# Altium project Weapon_of_Aphelios.PrjPcb
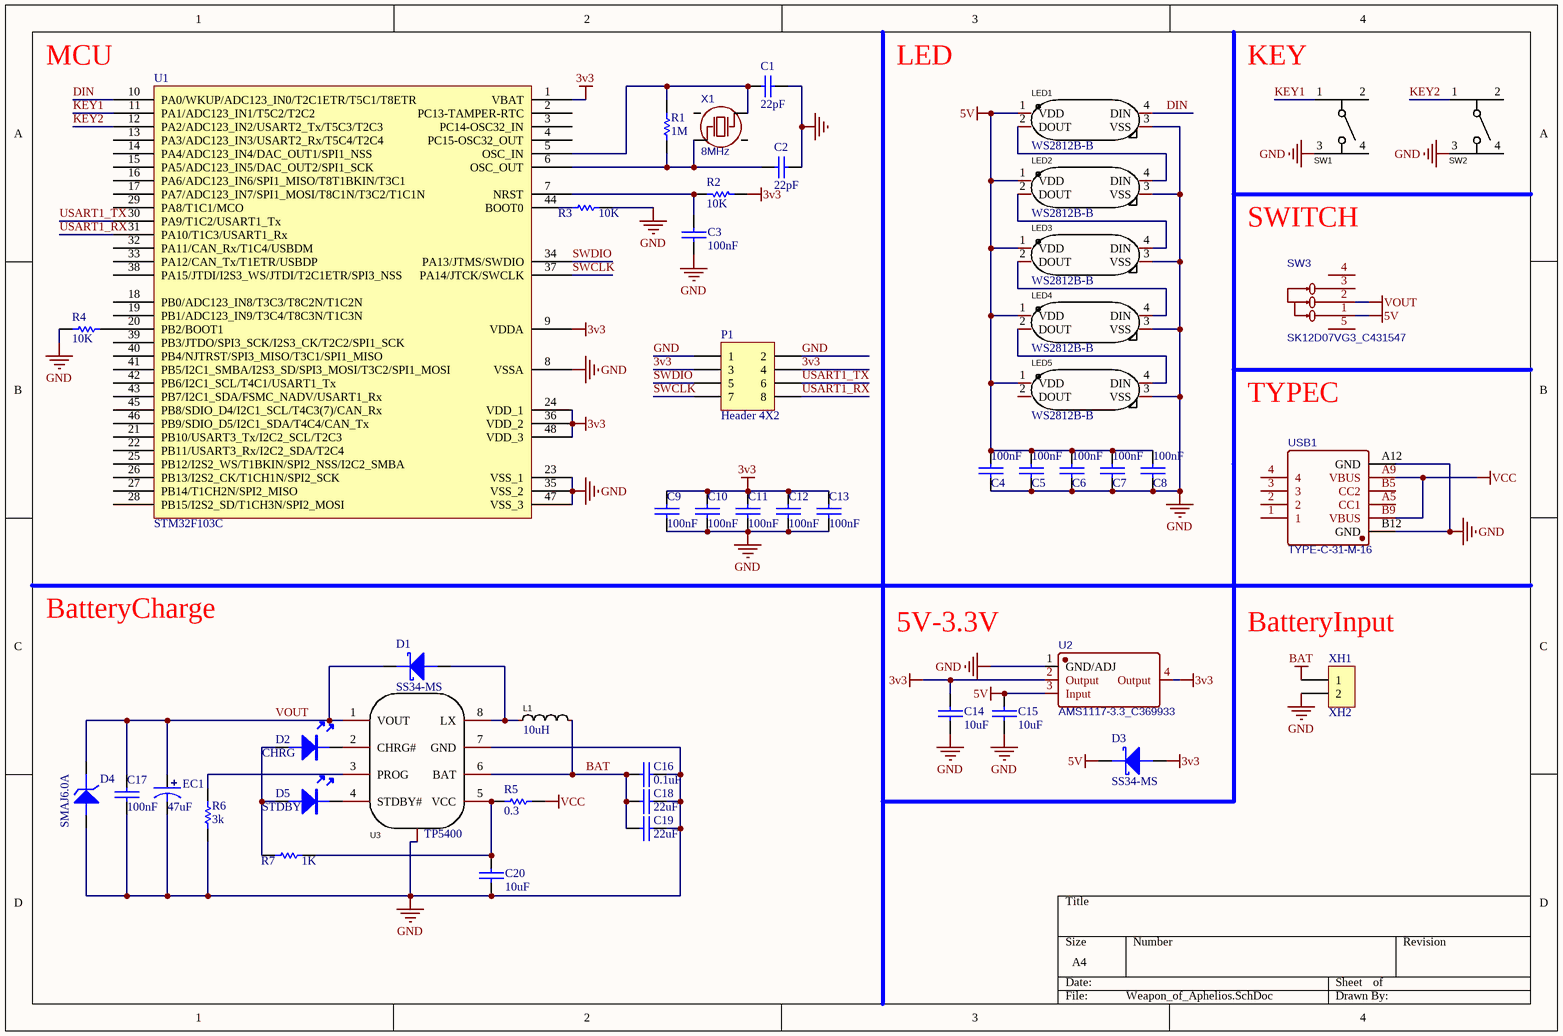
[diagram p0: Weapon_of_Aphelios.SchDoc]
1 sheet, 49 parts. Net scope: global (net labels, ports and power ports of the same name join across sheets).
Board file: Weapon_of_Aphelios.PcbDoc

## Sheet Weapon_of_Aphelios.SchDoc
size A4; SheetNumber: 1; SheetTotal: 1

### Parts
C1  22pF  [0603C]
C2  22pF  [0603C]
C3  100nF  [0603C]
C4  100nF  [0603C]
C5  100nF  [0603C]
C6  100nF  [0603C]
C7  100nF  [0603C]
C8  100nF  [0603C]
C9  100nF  [0603C]
C10  100nF  [0603C]
C11  100nF  [0603C]
C12  100nF  [0603C]
C13  100nF  [0603C]
C14  10uF  [0603C]
C15  10uF  [0603C]
C16  0.1uF  [0603C]
C17  100nF  [0603C]
C18  22uF  [0603C]
C19  22uF  [0603C]
C20  10uF  [0603C]
D1  SS34-MS  [SMA/DO-214AC]
D2  CHRG  [LED-0603B]
D3  SS34-MS  [SMA/DO-214AC]
D4  SMAJ6.0A  [SMA/DO-214AC]
D5  STDBY  [LED-0603B]
EC1  47uF  [SMD-EC5.0X5.3X5.4]
L1  10uH  [IND-SMD_L4.5-W4.1_TMPA0402SP]
LED1  WS2812B-B  [LED-SMD_4P-L5.0-W5.0-TL_WS2812B-B]
LED2  WS2812B-B  [LED-SMD_4P-L5.0-W5.0-TL_WS2812B-B]
LED3  WS2812B-B  [LED-SMD_4P-L5.0-W5.0-TL_WS2812B-B]
LED4  WS2812B-B  [LED-SMD_4P-L5.0-W5.0-TL_WS2812B-B]
LED5  WS2812B-B  [LED-SMD_4P-L5.0-W5.0-TL_WS2812B-B]
P1  Header 4X2  [HDR2X4]
R1  1M  [0603R]
R2  10K  [0603R]
R3  10K  [0603R]
R4  10K  [0603R]
R5  0.3  [0603R]
R6  3k  [0603R]
R7  1K  [0603R]
SW1  TL3301EF100QG  [KEY-SMD_4P-L6.0-W6.0-P4.50-LS10.0]  (value not drawn)
SW2  TL3301EF100QG  [KEY-SMD_4P-L6.0-W6.0-P4.50-LS10.0]  (value not drawn)
SW3  SK12D07VG3_C431547  [SW-TH_SK12D07VG3]
U1  STM32F103C  [LQFP-48_M]
U2  AMS1117-3.3_C369933  [SOT-223-4_L6.5-W3.5-P2.30-LS7.0-BR]
U3  TP5400  [SOIC-8_L5.0-W4.0-P1.27-LS6.0-BL-EP2.0]
USB1  TYPE-C-31-M-16  [TYPE-C-31-M-16]
X1  8MHz  [OSC-SMD_4P-L3.2-W2.5-BL]
XH1  XH2  [XH2/2.54mm/90]

### Nets
3v3: C9.2 C10.2 C11.2 C12.2 C13.2 C14.2 D3.A P1.3 P1.4 R2.1 U1.1(VBAT) U1.9(VDDA) U1.24(VDD_1) U1.36(VDD_2) U1.48(VDD_3) U2.2(Output) U2.4(Output)
5V: C4.2 C5.2 C6.2 C7.2 C8.2 C15.2 D3.K LED1.1(VDD) LED2.1(VDD) LED3.1(VDD) LED4.1(VDD) LED5.1(VDD) SW3.1 U2.3(Input)
BAT: C16.1 C18.1 C19.1 L1.2 U3.6(BAT) XH1.1
GND: C1.1 C2.1 C3.2 C4.1 C5.1 C6.1 C7.1 C8.1 C9.1 C10.1 C11.1 C12.1 C13.1 C14.1 C15.1 C16.2 C17.1 C18.2 C19.2 C20.1 D4.A EC1.2 LED1.3(VSS) LED2.3(VSS) LED3.3(VSS) LED4.3(VSS) LED5.3(VSS) P1.1 P1.2 R3.1 R4.1 R6.2 SW1.3 SW2.3 U1.8(VSSA) U1.23(VSS_1) U1.35(VSS_2) U1.47(VSS_3) U2.1(GND/ADJ) U3.7(GND) U3.9 USB1.A12(GND) USB1.B12(GND) XH1.2
VCC: R5.1 USB1.A9(VBUS) USB1.B9(VBUS)
VOUT: C17.2 D1.K D4.K EC1.1 SW3.2 U3.1(VOUT)
DIN: LED1.4(DIN) U1.10(PA0/WKUP/ADC123_IN0/T2C1ETR/T5C1/T8ETR)
KEY1: SW1.1 U1.11(PA1/ADC123_IN1/T5C2/T2C2)
KEY2: SW2.1 U1.12(PA2/ADC123_IN2/USART2_Tx/T5C3/T2C3)
SWCLK: P1.7 U1.37(PA14/JTCK/SWCLK)
SWDIO: P1.5 U1.34(PA13/JTMS/SWDIO)
USART1_RX: P1.8 U1.31(PA10/T1C3/USART1_Rx)
USART1_TX: P1.6 U1.30(PA9/T1C2/USART1_Tx)
NetC1_2: C1.2 R1.1 U1.5(OSC_IN) X1.3
NetC2_2: C2.2 R1.2 U1.6(OSC_OUT) X1.1
NetC3_1: C3.1 R2.2 U1.7(NRST)
NetC20_2: C20.2 R5.2 R7.1 U3.5(VCC)
NetD1_A: D1.A L1.1 U3.8(LX)
NetD2_A: D2.A D5.A R7.2
NetD2_K: D2.K U3.2(CHRG#)
NetD5_K: D5.K U3.4(STDBY#)
NetLED1_2: LED1.2(DOUT) LED2.4(DIN)
NetLED2_2: LED2.2(DOUT) LED3.4(DIN)
NetLED3_2: LED3.2(DOUT) LED4.4(DIN)
NetLED4_2: LED4.2(DOUT) LED5.4(DIN)
NetR3_2: R3.2 U1.44(BOOT0)
NetR4_2: R4.2 U1.20(PB2/BOOT1)
NetR6_1: R6.1 U3.3(PROG)

Not connected (* = marked no-connect by the designer): LED5 2(DOUT); SW1 2 4; SW2 2 4; SW3 3 4 5; U1 2(PC13-TAMPER-RTC) 3(PC14-OSC32_IN) 4(PC15-OSC32_OUT) 13(PA3/ADC123_IN3/USART2_Rx/T5C4/T2C4) 14(PA4/ADC123_IN4/DAC_OUT1/SPI1_NSS) 15(PA5/ADC123_IN5/DAC_OUT2/SPI1_SCK) 16(PA6/ADC123_IN6/SPI1_MISO/T8T1BKIN/T3C1) 17(PA7/ADC123_IN7/SPI1_MOSI/T8C1N/T3C2/T1C1N) 18(PB0/ADC123_IN8/T3C3/T8C2N/T1C2N) 19(PB1/ADC123_IN9/T3C4/T8C3N/T1C3N) 21(PB10/USART3_Tx/I2C2_SCL/T2C3) 22(PB11/USART3_Rx/I2C2_SDA/T2C4) 25(PB12/I2S2_WS/T1BKIN/SPI2_NSS/I2C2_SMBA) 26(PB13/I2S2_CK/T1CH1N/SPI2_SCK) 27(PB14/T1CH2N/SPI2_MISO) 28(PB15/I2S2_SD/T1CH3N/SPI2_MOSI) 29(PA8/T1C1/MCO) 32(PA11/CAN_Rx/T1C4/USBDM) 33(PA12/CAN_Tx/T1ETR/USBDP) 38(PA15/JTDI/I2S3_WS/JTDI/T2C1ETR/SPI3_NSS) 39(PB3/JTDO/SPI3_SCK/I2S3_CK/T2C2/SPI1_SCK) 40(PB4/NJTRST/SPI3_MISO/T3C1/SPI1_MISO) 41(PB5/I2C1_SMBA/I2S3_SD/SPI3_MOSI/T3C2/SPI1_MOSI) 42(PB6/I2C1_SCL/T4C1/USART1_Tx) 43(PB7/I2C1_SDA/FSMC_NADV/USART1_Rx) 45(PB8/SDIO_D4/I2C1_SCL/T4C3(7)/CAN_Rx) 46(PB9/SDIO_D5/I2C1_SDA/T4C4/CAN_Tx); USB1 1 2 3 4 A5(CC1) B5(CC2); X1 2 4

### Notes on the sheet
- MCU
- LED
- (near SW1) KEY
- SWITCH
- TYPEC
- BatteryCharge
- 5V-3.3V
- (near XH1) BatteryInput

### Library data of the parts
C1 C2 = CAP
C3-C20 = CAP: 无极性电容
D1 D3 = DIODE SCHOTTKY: 肖特基二极管
D2 D5 = LED
D4 = DIODE ZENER: 瞬态二极管 SMAJ6.0A DO-214AC 6.0V
EC1 = SMD_ECAP: 贴片电解电容
L1 = TMPC0402HP-100MG-Z02: Manufacturer: 台庆; Add into BOM: yes; Tolerance: ±20%; Rated Current: 1.4A; DC Resistance (DCR): 215mΩ; Name: 10uH; Symbol: TMPC0402HP-100MG-Z02; Device: TMPC0402HP-100MG-Z02; LCSC Part Name: 10uH ±20% 1.4A 215mΩ; Supplier Part: C305203; Manufacturer Part: TMPC0402HP-100MG-Z02; Supplier Footprint: SMD; JLCPCB Part Class: Extended Part; Datasheet: https://atta.szlcsc.com/upload/public/pdf/source/20200917/C305203_F071C71654DE86DE842DF29DC4BB6A78.pdf; Supplier: LCSC; Convert to PCB: yes; Value: 10uH
LED1-LED5 = WS2812B-B: Manufacturer: worldsemi; Add into BOM: yes; Emitted Color: RGB三色; Name: WS2812B-B; Symbol: WS2812B-B; Device: WS2812B-B; LCSC Part Name: RGB三色 （注意防潮，请查阅规格书中对应具体内容）; Supplier Part: C114586; Manufacturer Part: WS2812B-B; Supplier Footprint: 5050(mm); JLCPCB Part Class: Extended Part; Datasheet: https://atta.szlcsc.com/upload/public/pdf/source/20200615/C114586_26EB6813EC9F2A3F6C7FBB2AD75DE01F.pdf; Supplier: LCSC; Convert to PCB: yes
P1 = Header 4X2: Header, 4-Pin, Dual row; LatestRevisionDate: 17-Jul-2002; LatestRevisionNote: Re-released for DXP Platform.; Publisher: Altium Limited
R1-R7 = RES
SW1 SW2 = TL3301EF100QG: Manufacturer: E-Switch; Add into BOM: yes; Contact Current: 50mA; Voltage Rating (DC): 12V; Circuit: 单刀单掷; Actuator Style: 圆形按钮; Switch Length: 6mm; Switch Height: 3.7mm; Name: TL3301EF100QG; Symbol: TL3301EF100QG; Device: TL3301EF100QG; LCSC Part Name: TL3301EF100QG; Supplier Part: C273499; Manufacturer Part: TL3301EF100QG; Supplier Footprint: SMD,6x6mm; JLCPCB Part Class: Extended Part; Datasheet: https://atta.szlcsc.com/upload/public/pdf/source/20181030/C273499_C7AAC60B73C66F9CC8848B3DA9BBFF04.pdf; Supplier: LCSC; Convert to PCB: yes; Mounting Style: 立贴; With Lamp: -; Switch Width: 6mm
SW3 = SK12D07VG3_C431547: BOM_Manufacturer: SHOU HAN; Contributor: LCSC; BOM_Supplier: LCSC; BOM_Supplier Part: C431547; BOM_Manufacturer Part: SK12D07VG3; BOM_JLCPCB Part Class: Extended Part; spicePre: S; spiceSymbolName: SK12D07VG3_C431547
U1 = STM32F103C: STM32单片机48引脚
U2 = AMS1117-3.3_C369933: BOM_Manufacturer: KEXIN; Contributor: LCSC; BOM_Paste Type: expand; BOM_Assembly Type: smtWeld; BOM_Supplier: LCSC; BOM_Supplier Part: C369933; BOM_Manufacturer Part: AMS1117-3.3; spicePre: U; spiceSymbolName: AMS1117-3.3_C369933
U3 = TP5400: Manufacturer: TOPPOWER(南京拓微); Add into BOM: yes; Name: TP5400; Symbol: TP5400; Device: TP5400; LCSC Part Name: TP5400; Supplier Part: C24154; Manufacturer Part: TP5400; Supplier Footprint: SOIC-8_EP_150mil; JLCPCB Part Class: Extended Part; Datasheet: https://atta.szlcsc.com/upload/public/pdf/source/20131206/1457706662490.pdf; Supplier: LCSC; Convert to PCB: yes; Battery Chemistry: -; Number of Cells: -; Charge Current - Max: -; Battery Pack Voltage: -; Voltage - Supply (Max): -; Interface: -
X1 = 8MHz 10pF ±10ppm: BOM_Manufacturer: Zhejiang Abel Elec; BOM_Manufacturer Part: TAXM8M4RDBCCT2T; nameAlias: Frequency; Contributor: LCSC; BOM_Paste Type: expand; BOM_Assembly Type: smtWeld; BOM_Supplier: LCSC; BOM_Supplier Part: C400090; spicePre: X; spiceSymbolName: TAXM8M4RDBCCT2T